# Altium project Sailbot Main Controller.PrjPcb
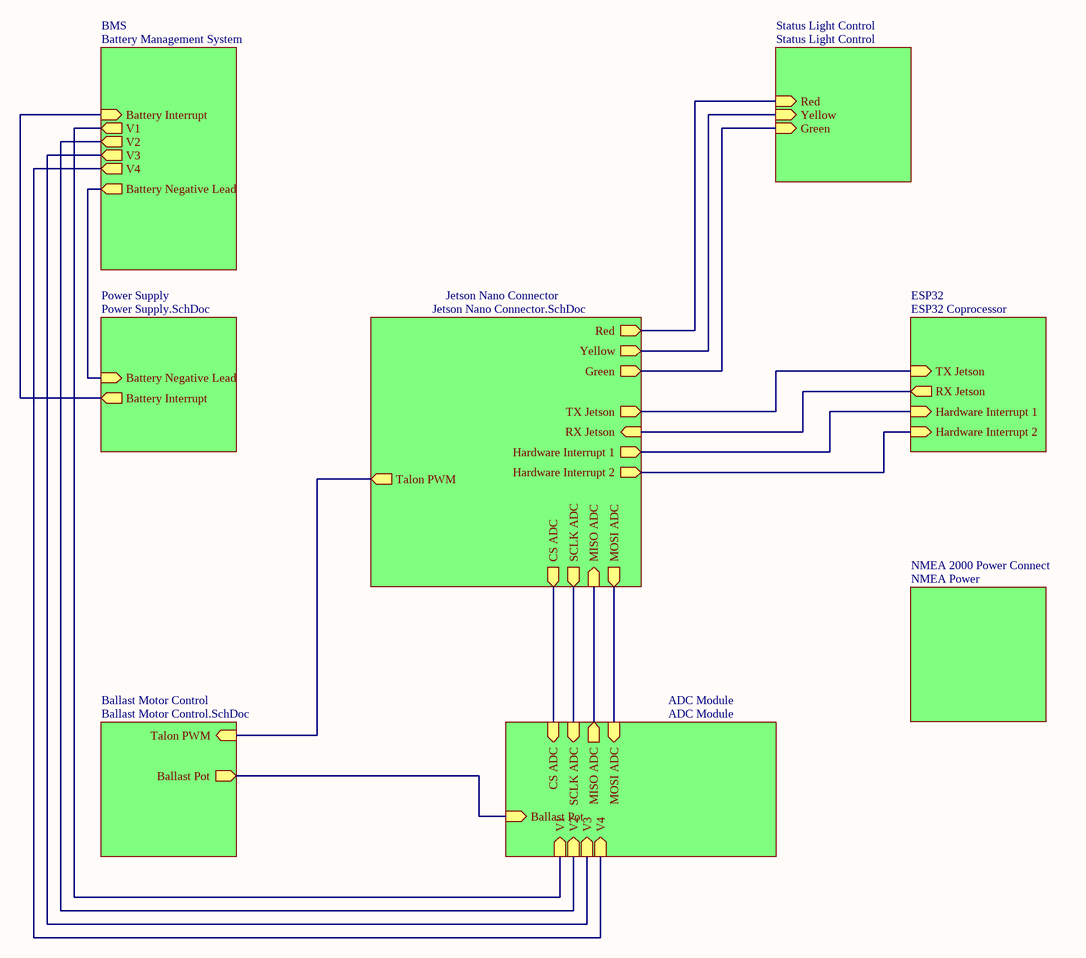
[diagram p0: Sailbot Sheet Map.SchDoc]
12 sheets, 86 parts. Net scope: hierarchical (ports join the sheet entries above them; power ports are global).
Board file: Main Board Layout.PcbDoc
Sheets:
  Sailbot Sheet Map.SchDoc
    Power Supply = Power Supply.SchDoc
    Jetson Nano Connector = Jetson Nano Connector.SchDoc
    Ballast Motor Control = Ballast Motor Control.SchDoc
    ADC Module = ADC Module.SchDoc
    Status Light Control = Status Light Control.SchDoc
    BMS = Battery Management System.SchDoc
    NMEA 2000 Power Connect = NMEA Power.SchDoc
    ESP32 = ESP32 Coprocessor.SchDoc
  Revised Sheetmap.SchDoc
  Initital Sheetmap.SchDoc
  Sail Sheetmap.SchDoc

## Sheet Sailbot Sheet Map.SchDoc
size D; SheetNumber: 1; SheetTotal: 12

### Sub-sheets
ADC Module = ADC Module: Ballast Pot (in), MISO ADC (out), MOSI ADC (in), V1 (in), V2 (in), V3 (in), V4 (in), SCLK ADC (in), CS ADC (in)
Ballast Motor Control = Ballast Motor Control.SchDoc: Talon PWM (in), Ballast Pot (out)
BMS = Battery Management System: Battery Interrupt (in), V1 (out), V2 (out), V3 (out), V4 (out), Battery Negative Lead (out)
ESP32 = ESP32 Coprocessor: TX Jetson (in), RX Jetson (out), Hardware Interrupt 1 (in), Hardware Interrupt 2 (in)
Jetson Nano Connector = Jetson Nano Connector.SchDoc: Red (out), Yellow (out), Green (out), Talon PWM (out), MISO ADC (in), MOSI ADC (out), SCLK ADC (out), CS ADC (out), TX Jetson (out), RX Jetson (in), Hardware Interrupt 1 (out), Hardware Interrupt 2 (out)
NMEA 2000 Power Connect = NMEA Power: no entries
Power Supply = Power Supply.SchDoc: Battery Interrupt (out), Battery Negative Lead (in)
Status Light Control = Status Light Control: Yellow (in), Green (in), Red (in)

### Nets
NetB3_5: sheet Ballast Motor Control/Ballast Pot, sheet ADC Module/Ballast Pot
NetB3_10: sheet Jetson Nano Connector/CS ADC, sheet ADC Module/CS ADC
NetB3_11: sheet Jetson Nano Connector/MOSI ADC, sheet ADC Module/MOSI ADC
NetB3_12: sheet Jetson Nano Connector/MISO ADC, sheet ADC Module/MISO ADC
NetB3_13: sheet Jetson Nano Connector/SCLK ADC, sheet ADC Module/SCLK ADC
NetJ1_11: sheet Power Supply/Battery Negative Lead, sheet BMS/Battery Negative Lead
NetJ2_8: sheet Jetson Nano Connector/TX Jetson, sheet ESP32/TX Jetson
NetJ2_10: sheet Jetson Nano Connector/RX Jetson, sheet ESP32/RX Jetson
NetJ2_12: sheet Jetson Nano Connector/Talon PWM, sheet Ballast Motor Control/Talon PWM
NetJ2_15: sheet Jetson Nano Connector/Green, sheet Status Light Control/Green
NetJ2_29: sheet Jetson Nano Connector/Red, sheet Status Light Control/Red
NetJ2_31: sheet Jetson Nano Connector/Yellow, sheet Status Light Control/Yellow
NetJ2_32: sheet Jetson Nano Connector/Hardware Interrupt 2, sheet ESP32/Hardware Interrupt 2
NetJ2_33: sheet Jetson Nano Connector/Hardware Interrupt 1, sheet ESP32/Hardware Interrupt 1
NetJ10_2: sheet ADC Module/V4, sheet BMS/V4
NetJ10_3: sheet ADC Module/V3, sheet BMS/V3
NetJ10_4: sheet ADC Module/V2, sheet BMS/V2
NetJ10_5: sheet ADC Module/V1, sheet BMS/V1
NetQ1_4: sheet Power Supply/Battery Interrupt, sheet BMS/Battery Interrupt

## Sheet Power Supply.SchDoc
size A; SheetNumber: 2; SheetTotal: 10
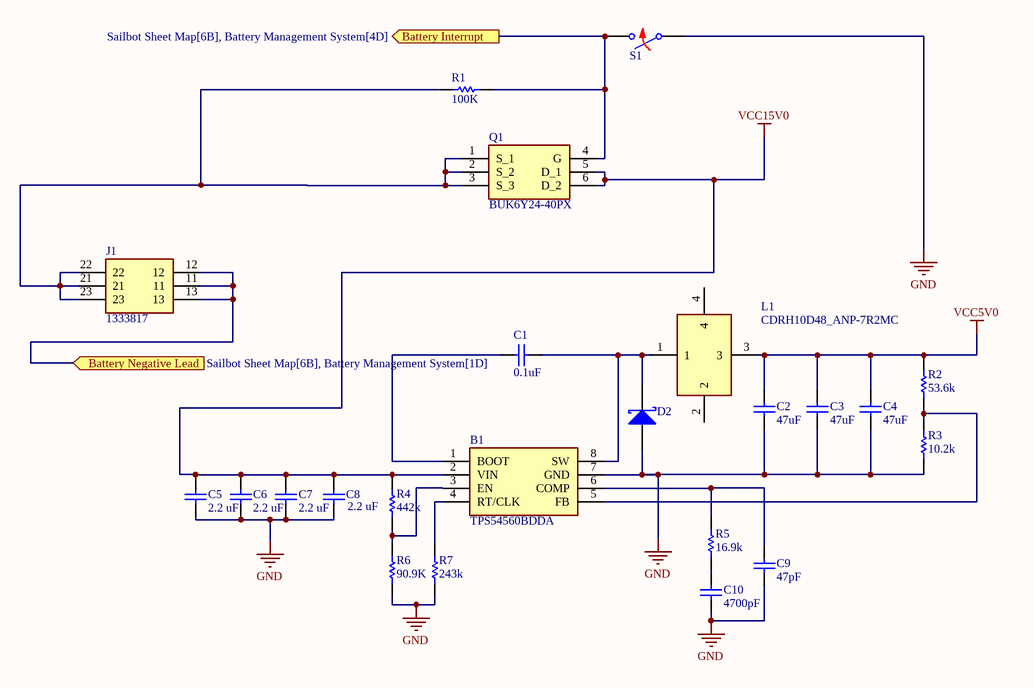
[diagram p1: Power Supply.SchDoc]

### Parts
B1  TPS54560BDDA  [SOIC127P600X170-8N]
C1  value 0.1uF  [C0805]  (hidden comment: Capacitor)
C2  value 47uF  [C0805]  (hidden comment: Capacitor)
C3  value 47uF  [C0805]  (hidden comment: Capacitor)
C4  value 47uF  [C0805]  (hidden comment: Capacitor)
C5  value 2.2 uF  [C0805]  (hidden comment: Capacitor)
C6  value 2.2 uF  [C0805]  (hidden comment: Capacitor)
C7  value 2.2 uF  [C0805]  (hidden comment: Capacitor)
C8  value 2.2 uF  [C0805]  (hidden comment: Capacitor)
C9  value 47pF  [C0805]  (hidden comment: Capacitor)
C10  value 4700pF  [C0805]  (hidden comment: Capacitor)
D2  Shottky Diode  [DIOM7959X250N]  (value not drawn)
J1  1333817  [1333817]
L1  CDRH10D48_ANP-7R2MC  [CDRH10D48ANP7R2MC]
Q1  BUK6Y24-40PX  [BUK6Y2440PX]
R1  value 100K  [6-0805_M]  (hidden comment: Resistor)
R2  value 53.6k  [6-0805_M]  (hidden comment: Resistor)
R3  value 10.2k  [6-0805_M]  (hidden comment: Resistor)
R4  value 442k  [6-0805_M]  (hidden comment: Resistor)
R5  value 16.9k  [6-0805_M]  (hidden comment: Resistor)
R6  value 90.9K  [6-0805_M]  (hidden comment: Resistor)
R7  value 243k  [6-0805_M]  (hidden comment: Resistor)
S1  Switch Normally Opened  (value not drawn)

### Ports
Battery Interrupt (out, see Sailbot Sheet Map[6B], Battery Management System[4D]), Battery Negative Lead (in, see Sailbot Sheet Map[6B], Battery Management System[1D])

### Nets
GND: B1.7(GND) C2.1 C3.1 C4.1 C5.1 C6.1 C7.1 C8.1 C9.1 C10.1 D2.1(A) R3.1 R6.1 R7.1 S1.1
VCC5V0: C2.2 C3.2 C4.2 L1.3 R2.2
VCC15V0: B1.2(VIN) C5.2 C6.2 C7.2 C8.2 Q1.5(D_1) Q1.6(D_2) R4.2
NetB1_1: B1.1(BOOT) C1.1
NetB1_3: B1.3(EN) R4.1 R6.2
NetB1_4: B1.4(RT/CLK) R7.2
NetB1_5: B1.5(FB) R2.1 R3.2
NetB1_6: B1.6(COMP) C9.2 R5.2
NetB1_8: B1.8(SW) C1.2 D2.2(K) L1.1
NetC10_2: C10.2 R5.1
NetJ1_11: J1.11 J1.12 J1.13 ; port Battery Negative Lead
NetJ1_21: J1.21 J1.22 J1.23 Q1.1(S_1) Q1.2(S_2) Q1.3(S_3) R1.1
NetQ1_4: Q1.4(G) R1.2 S1.2 ; port Battery Interrupt

Not connected (* = marked no-connect by the designer): L1 2 4

### Library data of the parts
B1 = TPS54560BDDA: Switching Voltage Regulators A 595-TPS54560BDDAR; Manufacturer_Name: Texas Instruments; Geometry.Height: 1.7mm; Mouser Part Number: 595-TPS54560BDDA; Mouser Price/Stock: https://www.mouser.co.uk/ProductDetail/Texas-Instruments/TPS54560BDDA?qs=gZXFycFWdAMqSdZZ7nACGQ%3D%3D; Manufacturer_Part_Number: TPS54560BDDA; Datasheet Link: http://www.ti.com/lit/ds/symlink/tps54560b.pdf
C1-C10 = Capacitor: SimulationGenericComponent: True
D2 = Shottky Diode: AF: 1; BV: 0; BV_MAX: 1e99; EG: 1.11; FC: 0.5; IBV: 0.001; IS: 1e-14; MJSW: 0.33; NTUN: 30; TNOM: 27; XTI: 3; SimulationGenericComponent: True; CJO: 0; CJP: 0; CTA: 0; CTP: 0; FCS: 0.5; FV_MAX: 1e99; IKF: 0; IKR: 0; ISR: 1e-14; JSW: 0; JTUN: 0; JTUNSW: 0; KEG: 1; KF: 0; LEVEL: 1; N: 1; NBV: 1; NR: 1; NS: 1; PHP: 1; RS: 0; TCV: 0; TLEV: 0; TLEVC: 0; TM1: 0; TM2: 0; TPB: 0; TPHP: 0; TRS: 0; TRS2: 0; TT: 0; TTT1: 0; TTT2: 0; VJ: 1; XTITUN: 3
J1 = 1333817: Pluggable Terminal Blocks LPTA 16/ 2-10,0-ZB; Manufacturer_Name: Phoenix Contact; Geometry.Height: 46.4mm; Mouser Part Number: 651-1333817; Mouser Price/Stock: https://www.mouser.co.uk/ProductDetail/Phoenix-Contact/1333817?qs=Jm2GQyTW%2Fbi%252BbQzIAqu7ww%3D%3D; Manufacturer_Part_Number: 1333817; Datasheet Link: https://www.phoenixcontact.com/en-pc/products/pcb-terminal-block-lpta-16-2-100-zb-1333817
L1 = CDRH10D48_ANP-7R2MC: Fixed Inductors SMD Power Inductor; Manufacturer_Name: Sumida; Manufacturer_Part_Number: CDRH10D48/ANP-7R2MC; Geometry.Height: 5mm; Mouser Part Number: 851-CDRH10D48/ANP7R2; Mouser Price/Stock: https://www.mouser.co.uk/ProductDetail/Sumida/CDRH10D48-ANP-7R2MC?qs=mT6umqgwvA2FCldKZoKGVw%3D%3D; Datasheet Link: https://datasheet.datasheetarchive.com/originals/distributors/Datasheets-DGA11/2227373.pdf
Q1 = BUK6Y24-40PX: NEXPERIA - BUK6Y24-40PX - Power MOSFET, P Channel, 40 V, 39 A, 0.019 ohm, LFPAK56, Surface Mount; Geometry.Height: 1.2mm; Mouser Part Number: 771-BUK6Y24-40PX; Mouser Price/Stock: https://www.mouser.co.uk/ProductDetail/Nexperia/BUK6Y24-40PX?qs=vmHwEFxEFR8tyd2WwTEwBg%3D%3D; Manufacturer_Name: Nexperia; Manufacturer_Part_Number: BUK6Y24-40PX; Datasheet Link: https://assets.nexperia.com/documents/data-sheet/BUK6Y24-40P.pdf
R1-R7 = Resistor: TC1: 0; SimulationGenericComponent: True; TC2: 0
S1 = SW NO: closed: 0; Rclosed: 1m; Ropen: 1Meg; SimulationGenericComponent: True

## Sheet Jetson Nano Connector.SchDoc
size A; SheetNumber: 4; SheetTotal: 12
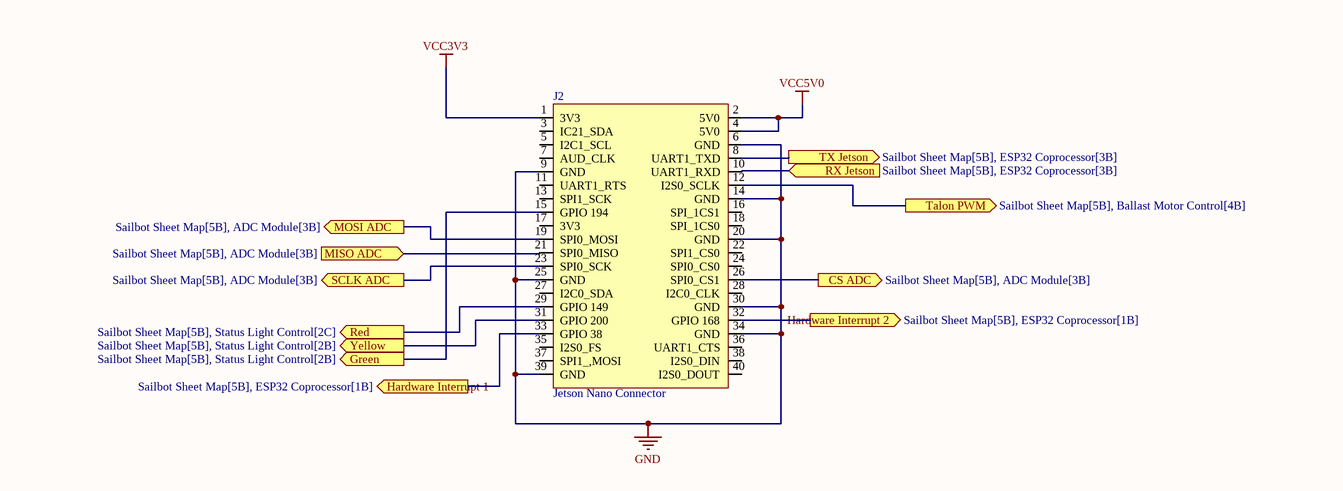
[diagram p2: Jetson Nano Connector.SchDoc]

### Parts
J2  Jetson Nano Connector  [Jetson Nano Header]

### Ports
CS ADC (out, see Sailbot Sheet Map[5B], ADC Module[3B]), Green (out, see Sailbot Sheet Map[5B], Status Light Control[2B]), Hardware Interrupt 1 (out, see Sailbot Sheet Map[5B], ESP32 Coprocessor[1B]), Hardware Interrupt 2 (out, see Sailbot Sheet Map[5B], ESP32 Coprocessor[1B]), MISO ADC (in, see Sailbot Sheet Map[5B], ADC Module[3B]), MOSI ADC (out, see Sailbot Sheet Map[5B], ADC Module[3B]), Red (out, see Sailbot Sheet Map[5B], Status Light Control[2C]), RX Jetson (in, see Sailbot Sheet Map[5B], ESP32 Coprocessor[3B]), SCLK ADC (out, see Sailbot Sheet Map[5B], ADC Module[3B]), Talon PWM (out, see Sailbot Sheet Map[5B], Ballast Motor Control[4B]), TX Jetson (out, see Sailbot Sheet Map[5B], ESP32 Coprocessor[3B]), Yellow (out, see Sailbot Sheet Map[5B], Status Light Control[2B])

### Nets
GND: J2.6(GND) J2.9(GND) J2.14(GND) J2.20(GND) J2.25(GND) J2.30(GND) J2.34(GND) J2.39(GND)
VCC3V3: J2.1(3V3)
VCC5V0: J2.2(5V0) J2.4(5V0)
NetB3_10: J2.26(SPI0_CS1) ; port CS ADC
NetB3_11: J2.19(SPI0_MOSI) ; port MOSI ADC
NetB3_12: J2.21(SPI0_MISO) ; port MISO ADC
NetB3_13: J2.23(SPI0_SCK) ; port SCLK ADC
NetJ2_8: J2.8(UART1_TXD) ; port TX Jetson
NetJ2_10: J2.10(UART1_RXD) ; port RX Jetson
NetJ2_12: J2.12(I2S0_SCLK) ; port Talon PWM
NetJ2_15: J2.15(GPIO_194) ; port Green
NetJ2_29: J2.29(GPIO_149) ; port Red
NetJ2_31: J2.31(GPIO_200) ; port Yellow
NetJ2_32: J2.32(GPIO_168) ; port Hardware Interrupt 2
NetJ2_33: J2.33(GPIO_38) ; port Hardware Interrupt 1

Not connected (* = marked no-connect by the designer): J2 3(IC21_SDA) 5(I2C1_SCL) 7(AUD_CLK) 11(UART1_RTS) 13(SPI1_SCK) 16(SPI_1CS1) 17(3V3) 18(SPI_1CS0) 22(SPI1_CS0) 24(SPI0_CS0) 27(I2C0_SDA) 28(I2C0_CLK) 35(I2S0_FS) 36(UART1_CTS) 37(SPI1_,MOSI) 38(I2S0_DIN) 40(I2S0_DOUT)

## Sheet Ballast Motor Control.SchDoc
size A; SheetNumber: 9; SheetTotal: 12
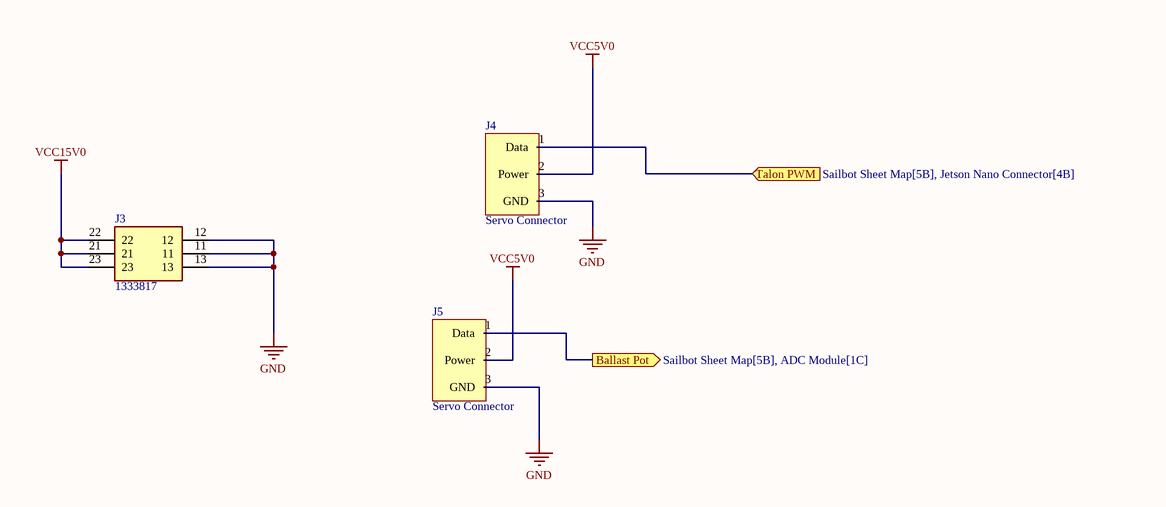
[diagram p3: Ballast Motor Control.SchDoc]

### Parts
(Parts that share a designator on the sheet are numbered #1, #2 ... from top to bottom, then left to right.)
J3#1  1333817  [1333817]
J4#1  Servo Connector  [3 Pin 0.1in Header]
J5#1  Servo Connector  [3 Pin 0.1in Header]

### Ports
Ballast Pot (out, see Sailbot Sheet Map[5B], ADC Module[1C]), Talon PWM (in, see Sailbot Sheet Map[5B], Jetson Nano Connector[4B])

### Nets
GND: J3#1.11 J3#1.12 J3#1.13 J4#1.3(GND) J5#1.3(GND)
VCC5V0: J4#1.2(Power) J5#1.2(Power)
VCC15V0: J3#1.21 J3#1.22 J3#1.23
NetB3_5: J5#1.1(Data) ; port Ballast Pot
NetJ2_12: J4#1.1(Data) ; port Talon PWM

### Library data of the parts
J3#1 = 1333817: as J1 on sheet Power Supply; Mouser Part Number: 651-1333817; Mouser Price/Stock: https://www.mouser.co.uk/ProductDetail/Phoenix-Contact/1333817?qs=Jm2GQyTW%2Fbi%252BbQzIAqu7ww%3D%3D; Manufacturer_Part_Number: 1333817; Datasheet Link: https://www.phoenixcontact.com/en-pc/products/pcb-terminal-block-lpta-16-2-100-zb-1333817

## Sheet ADC Module.SchDoc
size A; SheetNumber: 6; SheetTotal: 9
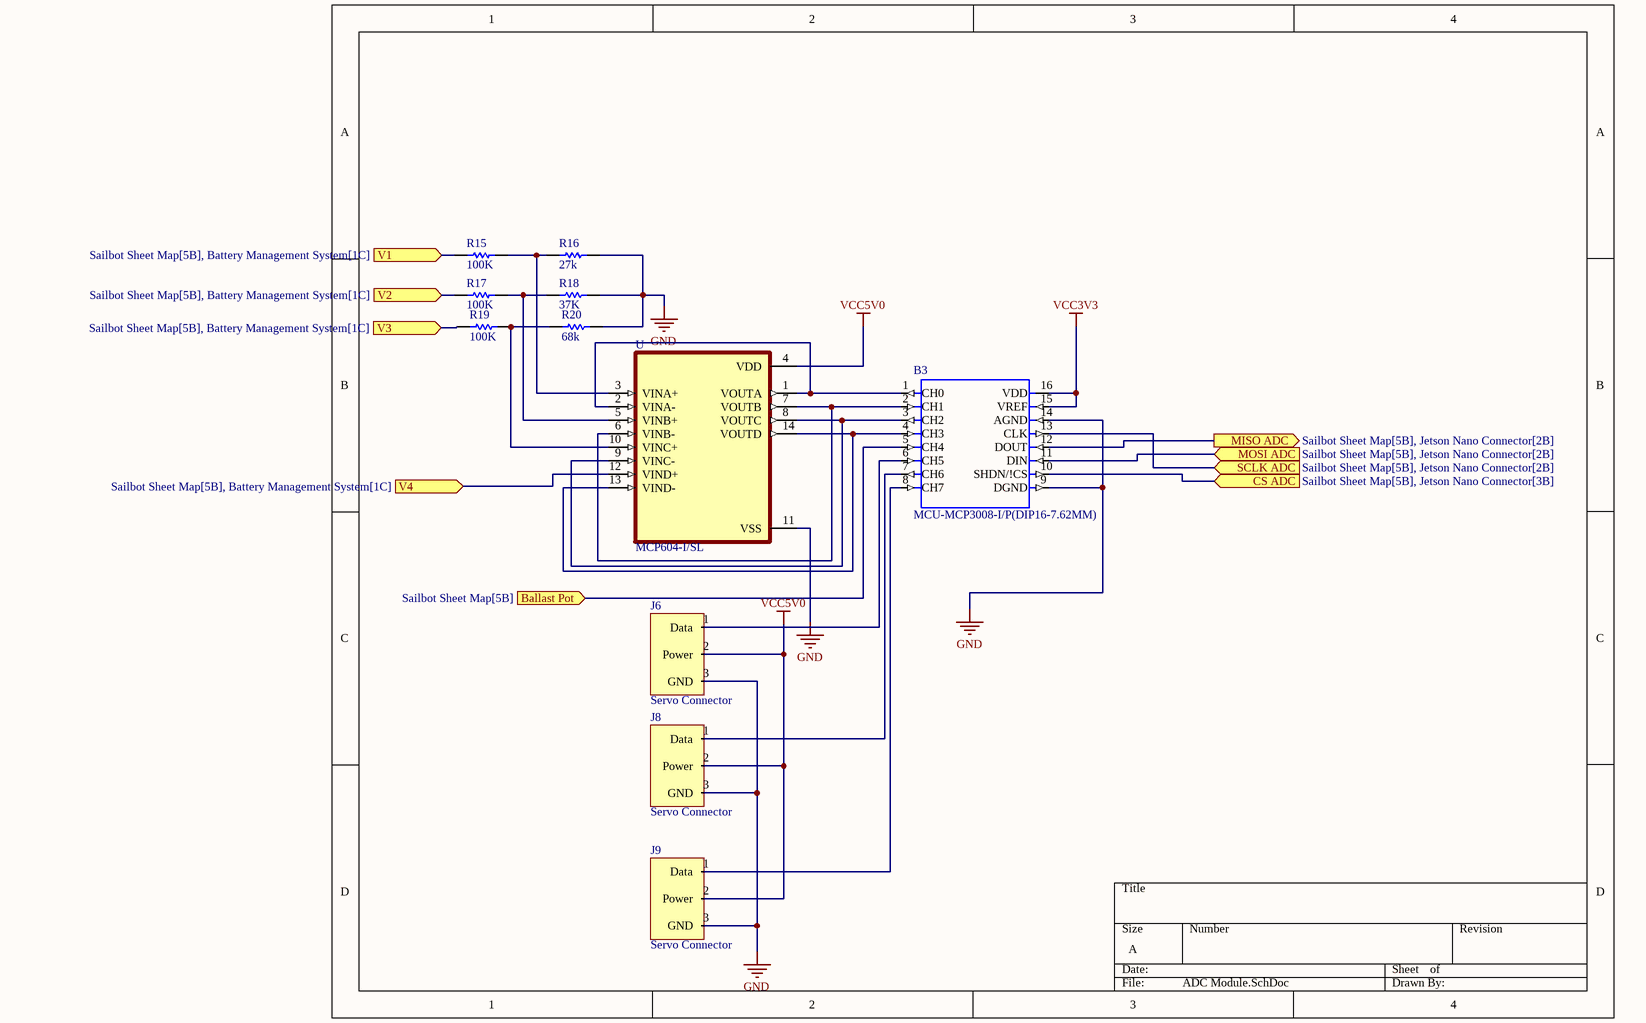
[diagram p4: ADC Module.SchDoc]

### Parts
B3  MCU-MCP3008-I/P(DIP16-7.62MM)  [DIP16-2.54-19.2X7.62MM]
J6  Servo Connector  [3 Pin 0.1in Header]
J8  Servo Connector  [3 Pin 0.1in Header]
J9  Servo Connector  [3 Pin 0.1in Header]
R15  value 100K  [6-0805_M]  (hidden comment: Resistor)
R16  value 27k  [6-0805_M]  (hidden comment: Resistor)
R17  value 100K  [6-0805_M]  (hidden comment: Resistor)
R18  value 37K  [6-0805_M]  (hidden comment: Resistor)
R19  value 100K  [6-0805_M]  (hidden comment: Resistor)
R20  value 68k  [6-0805_M]  (hidden comment: Resistor)
U  MCP604-I/SL  [SOIC127P600X175-14N]

### Ports
Ballast Pot (in, see Sailbot Sheet Map[5B]), CS ADC (in, see Sailbot Sheet Map[5B], Jetson Nano Connector[3B]), MISO ADC (out, see Sailbot Sheet Map[5B], Jetson Nano Connector[2B]), MOSI ADC (in, see Sailbot Sheet Map[5B], Jetson Nano Connector[2B]), SCLK ADC (in, see Sailbot Sheet Map[5B], Jetson Nano Connector[2B]), V1 (in, see Sailbot Sheet Map[5B], Battery Management System[1C]), V2 (in, see Sailbot Sheet Map[5B], Battery Management System[1C]), V3 (in, see Sailbot Sheet Map[5B], Battery Management System[1C]), V4 (in, see Sailbot Sheet Map[5B], Battery Management System[1C])

### Nets
GND: B3.9(DGND) B3.14(AGND) J6.3(GND) J8.3(GND) J9.3(GND) R16.1 R18.1 R20.2 U.11(VSS)
VCC3V3: B3.15(VREF) B3.16(VDD)
VCC5V0: J6.2(Power) J8.2(Power) J9.2(Power) U.4(VDD)
NetB3_1: B3.1(CH0) U.1(VOUTA) U.2(VINA-)
NetB3_2: B3.2(CH1) U.6(VINB-) U.7(VOUTB)
NetB3_3: B3.3(CH2) U.8(VOUTC) U.9(VINC-)
NetB3_4: B3.4(CH3) U.13(VIND-) U.14(VOUTD)
NetB3_5: B3.5(CH4) ; port Ballast Pot
NetB3_6: B3.6(CH5) J6.1(Data)
NetB3_7: B3.7(CH6) J8.1(Data)
NetB3_8: B3.8(CH7) J9.1(Data)
NetB3_10: B3.10(SHDN/!CS) ; port CS ADC
NetB3_11: B3.11(DIN) ; port MOSI ADC
NetB3_12: B3.12(DOUT) ; port MISO ADC
NetB3_13: B3.13(CLK) ; port SCLK ADC
NetJ10_2: U.12(VIND+) ; port V4
NetJ10_3: R19.2 ; port V3
NetJ10_4: R17.2 ; port V2
NetJ10_5: R15.2 ; port V1
NetR15_1: R15.1 R16.2 U.3(VINA+)
NetR17_1: R17.1 R18.2 U.5(VINB+)
NetR19_1: R19.1 R20.1 U.10(VINC+)

### Library data of the parts
B3 = MCU-MCP3008-I/P(DIP16-7.62MM): 10 Bit Analog to Digital Converter 4, 8 Input 1 SAR 16-PDIP; MF: Microchip; MP: MCP3008-I/P; Package: DIP-16 Microchip; SnapEDA_Link: https://www.snapeda.com/parts/MCP3008-I/P/Microchip/view-part/43628/?ref=snap; Availability: Unavailable; Price: None; Value: *
R15-R20 = Resistor: TC1: 0; SimulationGenericComponent: True; TC2: 0
U = MCP604-I/SL: General Purpose Amplifier 4 Circuit Rail-to-Rail 14-SOIC; MF: Microchip; Value: *; Package: SOIC-14 Microchip; MP: MCP604-I/SL; Price: None; SnapEDA_Link: https://www.snapeda.com/parts/MCP604-I/SL/Microchip/view-part/49119/?ref=snap; Availability: Unavailable

## Sheet Status Light Control.SchDoc
size A; SheetNumber: 4; SheetTotal: 10
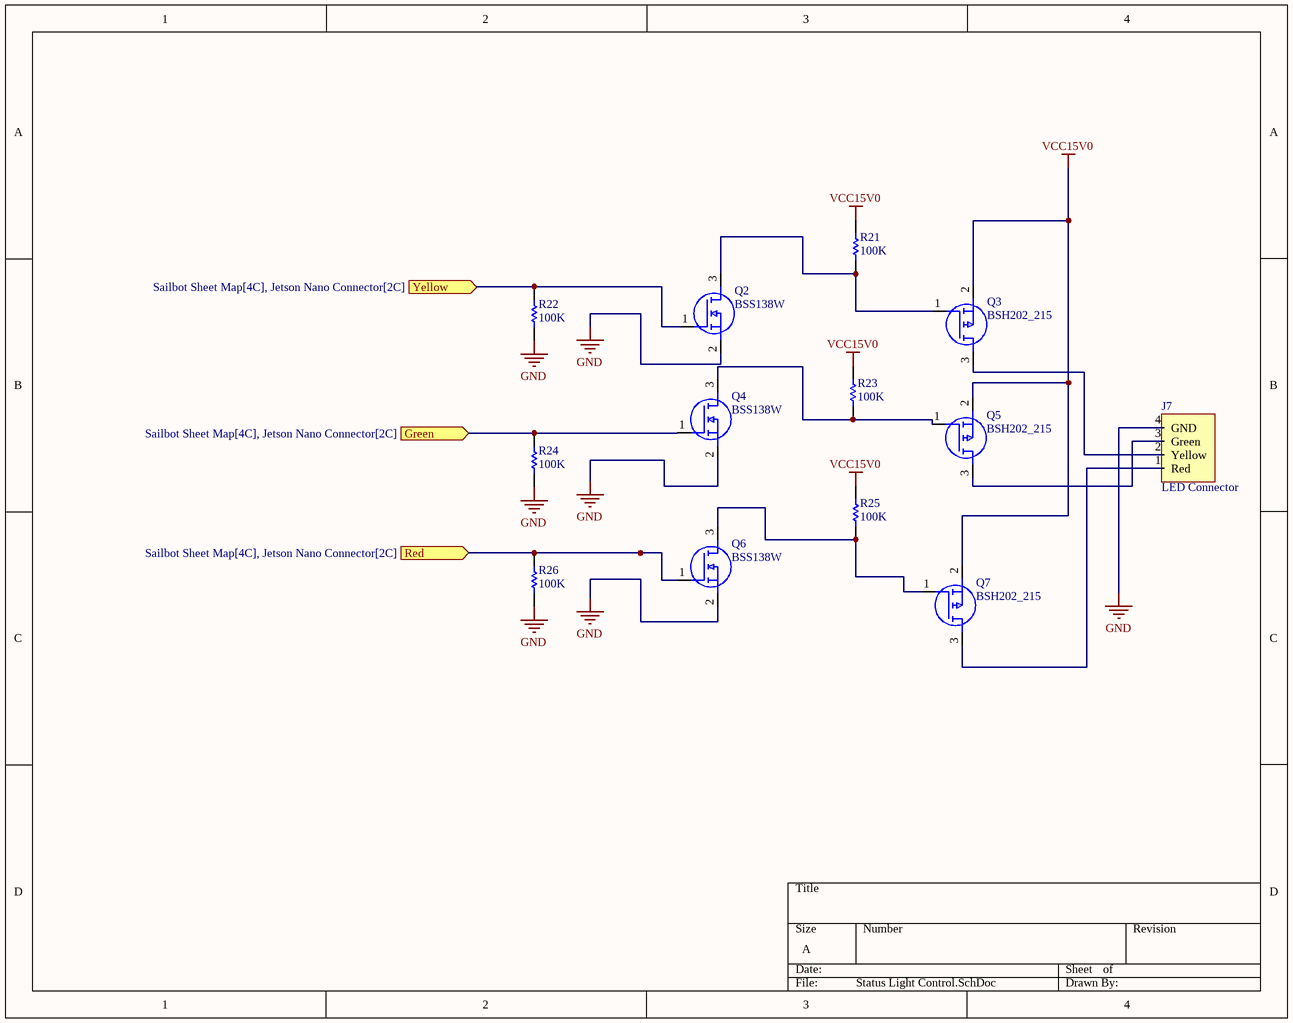
[diagram p5: Status Light Control.SchDoc]

### Parts
J7  LED Connector  [4 Pin 0.1in Header]
Q2  BSS138W  [SOT65P210X110-3N]
Q3  BSH202_215  [SOT95P230X110-3N]
Q4  BSS138W  [SOT65P210X110-3N]
Q5  BSH202_215  [SOT95P230X110-3N]
Q6  BSS138W  [SOT65P210X110-3N]
Q7  BSH202_215  [SOT95P230X110-3N]
R21  value 100K  [6-0805_M]  (hidden comment: Resistor)
R22  value 100K  [6-0805_M]  (hidden comment: Resistor)
R23  value 100K  [6-0805_M]  (hidden comment: Resistor)
R24  value 100K  [6-0805_M]  (hidden comment: Resistor)
R25  value 100K  [6-0805_M]  (hidden comment: Resistor)
R26  value 100K  [6-0805_M]  (hidden comment: Resistor)

### Ports
Green (in, see Sailbot Sheet Map[4C], Jetson Nano Connector[2C]), Red (in, see Sailbot Sheet Map[4C], Jetson Nano Connector[2C]), Yellow (in, see Sailbot Sheet Map[4C], Jetson Nano Connector[2C])

### Nets
GND: J7.4(GND) Q2.2(S) Q4.2(S) Q6.2(S) R22.1 R24.1 R26.1
VCC15V0: Q3.2(S) Q5.2(S) Q7.2(S) R21.2 R23.2 R25.2
NetJ2_15: Q4.1(G) R24.2 ; port Green
NetJ2_29: Q6.1(G) R26.2 ; port Red
NetJ2_31: Q2.1(G) R22.2 ; port Yellow
NetJ7_1: J7.1(Red) Q7.3(D)
NetJ7_2: J7.2(Yellow) Q3.3(D)
NetJ7_3: J7.3(Green) Q5.3(D)
NetQ2_3: Q2.3(D) Q3.1(G) R21.1
NetQ4_3: Q4.3(D) Q5.1(G) R23.1
NetQ6_3: Q6.3(D) Q7.1(G) R25.1

### Library data of the parts
Q2 Q4 Q6 = BSS138W: BSS138W N-Channel MOSFET, 210 mA, 50 V, 3-Pin SOT-323 ON Semiconductor; Manufacturer_Name: onsemi; Geometry.Height: 1.1mm; Mouser Part Number: 512-BSS138W; Mouser Price/Stock: https://www.mouser.co.uk/ProductDetail/onsemi-Fairchild/BSS138W?qs=iQhsftLtcNQX02h325QGXg%3D%3D; Manufacturer_Part_Number: BSS138W; Datasheet Link: https://www.onsemi.com/pub/Collateral/BSS138W-D.pdf
Q3 Q5 Q7 = BSH202_215: NEXPERIA - BSH202,215 - Power MOSFET, P Channel, 30 V, 520 mA, 0.63 ohm, SOT-23, Surface Mount; Geometry.Height: 1.1mm; Mouser Part Number: 771-BSH202215; Mouser Price/Stock: https://www.mouser.co.uk/ProductDetail/Nexperia/BSH202215?qs=me8TqzrmIYVIfEr%252BmEwLmg%3D%3D; Manufacturer_Name: Nexperia; Manufacturer_Part_Number: BSH202,215; Datasheet Link: https://assets.nexperia.com/documents/data-sheet/BSH202.pdf
R21-R26 = Resistor: TC1: 0; SimulationGenericComponent: True; TC2: 0

## Sheet Battery Management System.SchDoc
size A; SheetNumber: 5; SheetTotal: 9
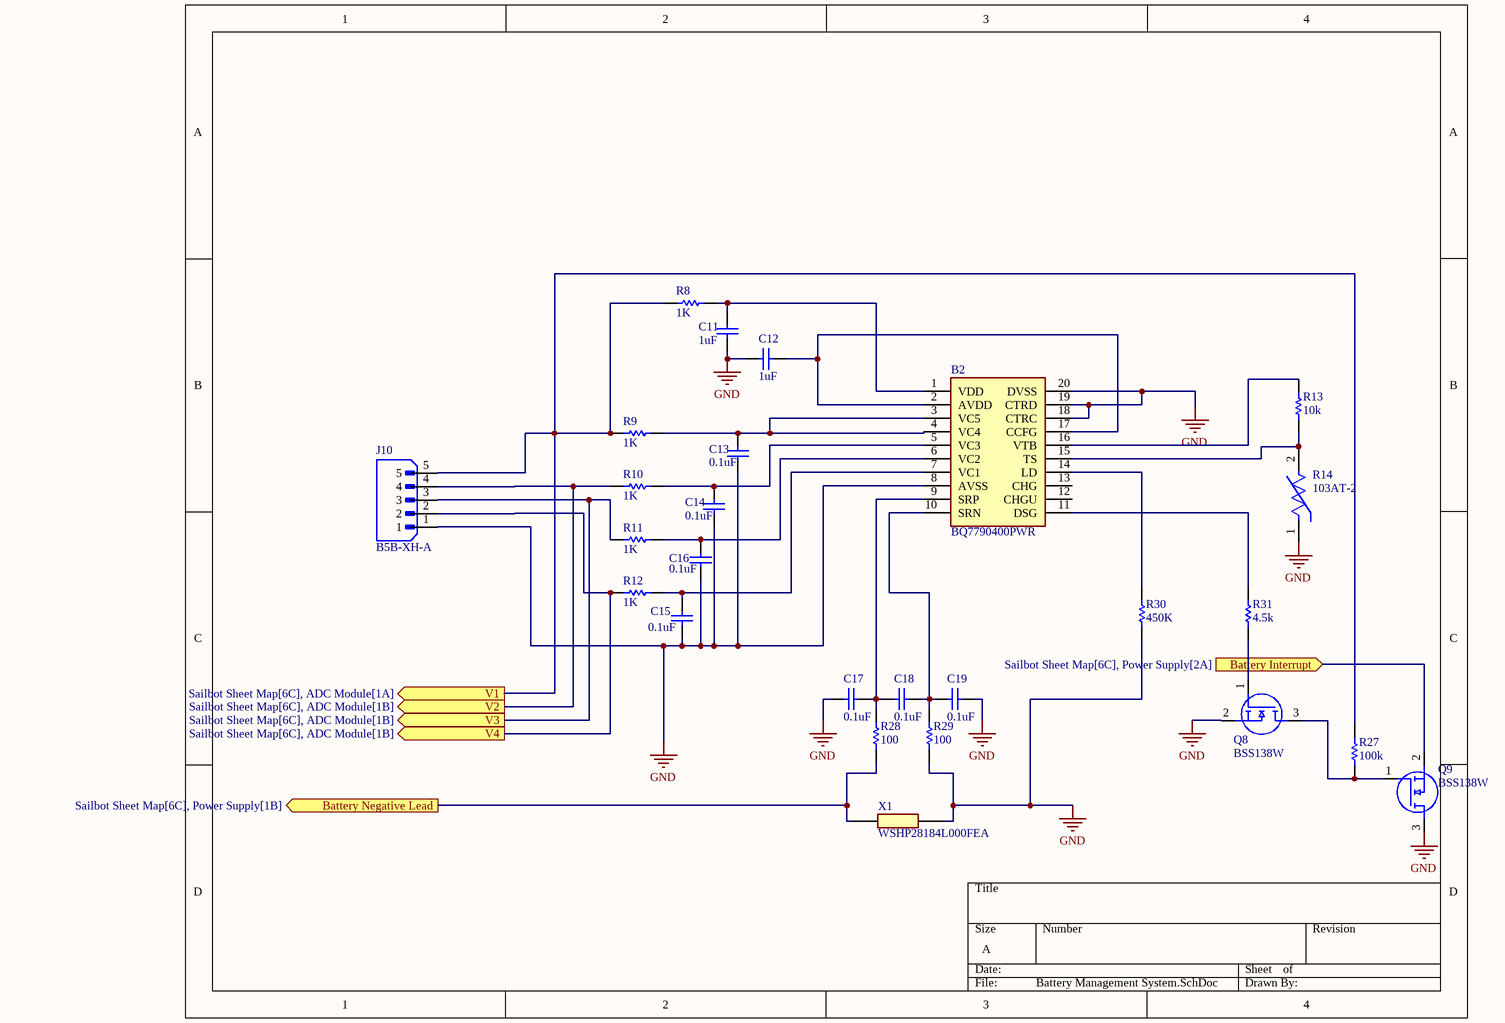
[diagram p6: Battery Management System.SchDoc]

### Parts
B2  BQ7790400PWR  [SOP65P640X120-20N]
C11  value 1uF  [C0805]  (hidden comment: Capacitor)
C12  value 1uF  [C0805]  (hidden comment: Capacitor)
C13  value 0.1uF  [C0805]  (hidden comment: Capacitor)
C14  value 0.1uF  [C0805]  (hidden comment: Capacitor)
C15  value 0.1uF  [C0805]  (hidden comment: Capacitor)
C16  value 0.1uF  [C0805]  (hidden comment: Capacitor)
C17  value 0.1uF  [C0805]  (hidden comment: Capacitor)
C18  value 0.1uF  [C0805]  (hidden comment: Capacitor)
C19  value 0.1uF  [C0805]  (hidden comment: Capacitor)
J10  B5B-XH-A  [JST_B5B-XH-A]
Q8  BSS138W  [SOT65P210X110-3N]
Q9  BSS138W  [SOT65P210X110-3N]
R8  value 1K  [6-0805_M]  (hidden comment: Resistor)
R9  value 1K  [6-0805_M]  (hidden comment: Resistor)
R10  value 1K  [6-0805_M]  (hidden comment: Resistor)
R11  value 1K  [6-0805_M]  (hidden comment: Resistor)
R12  value 1K  [6-0805_M]  (hidden comment: Resistor)
R13  value 10k  [6-0805_M]  (hidden comment: Resistor)
R14  103AT-2  [FP-103AT-2-MFG]
R27  value 100k  [6-0805_M]  (hidden comment: Resistor)
R28  value 100  [6-0805_M]  (hidden comment: Resistor)
R29  value 100  [6-0805_M]  (hidden comment: Resistor)
R30  value 450K  [6-0805_M]  (hidden comment: Resistor)
R31  value 4.5k  [6-0805_M]  (hidden comment: Resistor)
X1  WSHP28184L000FEA  [WSHP28184L000FEA]

### Ports
Battery Interrupt (in, see Sailbot Sheet Map[6C], Power Supply[2A]), Battery Negative Lead (out, see Sailbot Sheet Map[6C], Power Supply[1B]), V1 (out, see Sailbot Sheet Map[6C], ADC Module[1A]), V2 (out, see Sailbot Sheet Map[6C], ADC Module[1B]), V3 (out, see Sailbot Sheet Map[6C], ADC Module[1B]), V4 (out, see Sailbot Sheet Map[6C], ADC Module[1B])

### Nets
GND: B2.8(AVSS) B2.18(CTRC) B2.19(CTRD) B2.20(DVSS) C11.1 C12.2 C13.1 C14.1 C15.1 C16.1 C17.2 C19.1 J10.1 Q8.2(S) Q9.3(D) R14.1 R29.1 R30.1 X1.2
NetB2_1: B2.1(VDD) C11.2 R8.2
NetB2_2: B2.2(AVDD) B2.17(CCFG) C12.1
NetB2_3: B2.3(VC5) B2.4(VC4) C13.2 R9.2
NetB2_5: B2.5(VC3) C14.2 R10.2
NetB2_6: B2.6(VC2) C16.2 R11.2
NetB2_7: B2.7(VC1) C15.2 R12.2
NetB2_9: B2.9(SRP) C17.1 C18.2 R28.2
NetB2_10: B2.10(SRN) C18.1 C19.2 R29.2
NetB2_11: B2.11(DSG) R31.2
NetB2_14: B2.14(LD) R30.2
NetB2_15: B2.15(TS) R13.1 R14.2
NetB2_16: B2.16(VTB) R13.2
NetJ1_11: R28.1 X1.1 ; port Battery Negative Lead
NetJ10_2: J10.2 R12.1 ; port V4
NetJ10_3: J10.3 R11.1 ; port V3
NetJ10_4: J10.4 R10.1 ; port V2
NetJ10_5: J10.5 R8.1 R9.1 R27.2 ; port V1
NetQ1_4: Q9.2(S) ; port Battery Interrupt
NetQ8_1: Q8.1(G) R31.1
NetQ8_3: Q8.3(D) Q9.1(G) R27.1

Not connected (* = marked no-connect by the designer): B2 12(CHGU) 13(CHG)

### Library data of the parts
B2 = BQ7790400PWR: 3-4S Low Power Protector; Manufacturer_Name: Texas Instruments; Geometry.Height: 1.2mm; Mouser Part Number: 595-BQ7790400PWR; Mouser Price/Stock: https://www.mouser.co.uk/ProductDetail/Texas-Instruments/BQ7790400PWR?qs=SMCV84mnLhnU0KDK1YzY%252Bw%3D%3D; Manufacturer_Part_Number: BQ7790400PWR; Datasheet Link: http://www.ti.com/lit/gpn/bq77904
C11-C19 = Capacitor: SimulationGenericComponent: True
J10 = B5B-XH-A: Connector Header Through Hole 5 position 0.098 (2.50mm); MF: JST Sales; SnapEDA_Link: https://www.snapeda.com/parts/B5B-XH-A/JST+Sales+America+Inc./view-part/?ref=snap; Package: None; Value: *; MP: B5B-XH-A; Check_prices: https://www.snapeda.com/parts/B5B-XH-A/JST+Sales+America+Inc./view-part/?ref=eda
Q8 Q9 = BSS138W: as Q2 on sheet Status Light Control; Mouser Part Number: 512-BSS138W; Mouser Price/Stock: https://www.mouser.co.uk/ProductDetail/onsemi-Fairchild/BSS138W?qs=iQhsftLtcNQX02h325QGXg%3D%3D; Manufacturer_Part_Number: BSS138W; Datasheet Link: https://www.onsemi.com/pub/Collateral/BSS138W-D.pdf
R8-R13 R27-R31 = Resistor: TC1: 0; SimulationGenericComponent: True; TC2: 0
R14 = CMP-2000-05824-2: Thermistor NTC 10KOhm 1% 2-Pin; Resistance: 10kR; Lead Pitch: 2.54mm; Height: 2.4mm; Max Operating Temperature: 110°C; Width: 3.7mm; RoHS Compliant: Yes; Min Operating Temperature: -50°C; Termination: Radial; Packaging: Bulk; Number of Pins: 2; Series: AT; Tolerance: 1%; Length: 17mm
X1 = WSHP28184L000FEA: Current Sense Resistors - SMD 10W .004ohms 1%; Manufacturer_Name: Vishay; Geometry.Height: 1.75mm; Mouser Part Number: 71-WSHP28184L000FEA; Mouser Price/Stock: https://www.mouser.co.uk/ProductDetail/Vishay-Dale/WSHP28184L000FEA?qs=WY0B%252Bpw29jP7%252BmGFaWxGvg%3D%3D; Manufacturer_Part_Number: WSHP28184L000FEA; Datasheet Link: https://www.vishay.com/doc?30347

## Sheet NMEA Power.SchDoc
size A; SheetNumber: 8; SheetTotal: 11
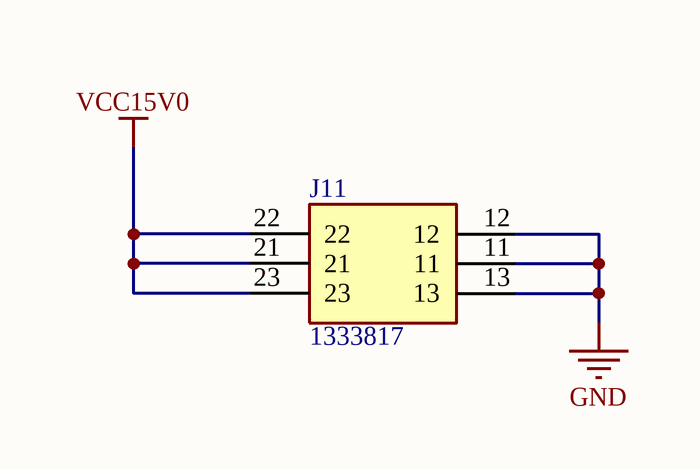
[diagram p7: NMEA Power.SchDoc]

### Parts
(Parts that share a designator on the sheet are numbered #1, #2 ... from top to bottom, then left to right.)
J11#1  1333817  [1333817]

### Nets
GND: J11#1.11 J11#1.12 J11#1.13
VCC15V0: J11#1.21 J11#1.22 J11#1.23

### Library data of the parts
J11#1 = 1333817: as J1 on sheet Power Supply; Mouser Part Number: 651-1333817; Mouser Price/Stock: https://www.mouser.co.uk/ProductDetail/Phoenix-Contact/1333817?qs=Jm2GQyTW%2Fbi%252BbQzIAqu7ww%3D%3D; Manufacturer_Part_Number: 1333817; Datasheet Link: https://www.phoenixcontact.com/en-pc/products/pcb-terminal-block-lpta-16-2-100-zb-1333817

## Sheet ESP32 Coprocessor.SchDoc
size A; SheetNumber: 9; SheetTotal: 12
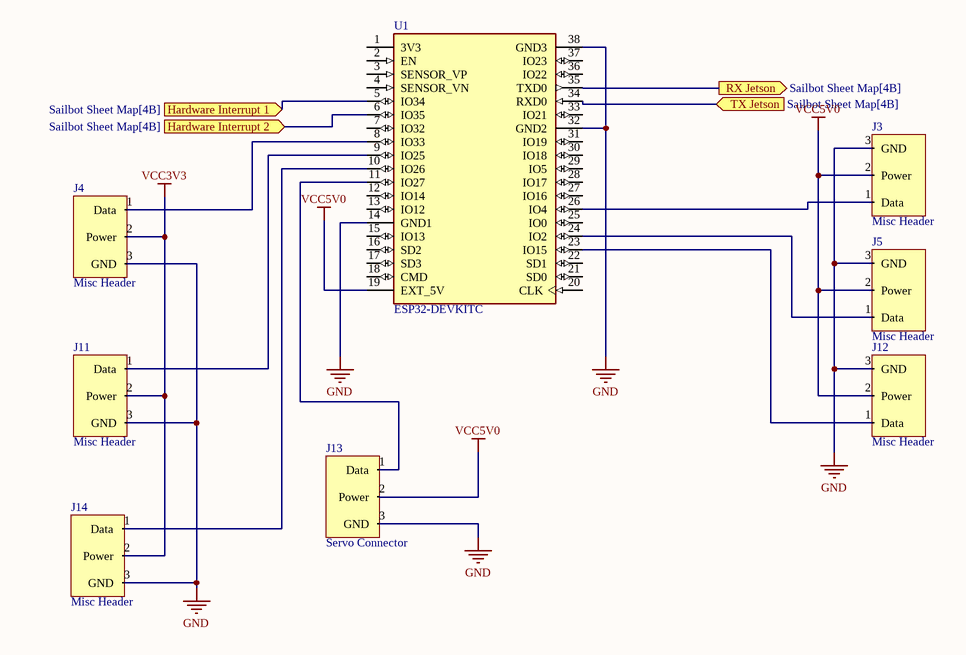
[diagram p8: ESP32 Coprocessor.SchDoc]

### Parts
(Parts that share a designator on the sheet are numbered #1, #2 ... from top to bottom, then left to right.)
J3#2  Misc Header  [3 Pin 0.1in Header]
J4#2  Misc Header  [3 Pin 0.1in Header]
J5#2  Misc Header  [3 Pin 0.1in Header]
J11#2  Misc Header  [3 Pin 0.1in Header]
J12  Misc Header  [3 Pin 0.1in Header]
J13  Servo Connector  [3 Pin 0.1in Header]
J14  Misc Header  [3 Pin 0.1in Header]
U1  ESP32-DEVKITC  [MODULE_ESP32-DEVKITC]

### Ports
Hardware Interrupt 1 (in, see Sailbot Sheet Map[4B]), Hardware Interrupt 2 (in, see Sailbot Sheet Map[4B]), RX Jetson (out, see Sailbot Sheet Map[4B]), TX Jetson (in, see Sailbot Sheet Map[4B])

### Nets
GND: J3#2.3(GND) J4#2.3(GND) J5#2.3(GND) J11#2.3(GND) J12.3(GND) J13.3(GND) J14.3(GND) U1.14(GND1) U1.32(GND2) U1.38(GND3)
VCC3V3: J4#2.2(Power) J11#2.2(Power) J14.2(Power)
VCC5V0: J3#2.2(Power) J5#2.2(Power) J12.2(Power) J13.2(Power) U1.19(EXT_5V)
NetJ2_8: U1.34(RXD0) ; port TX Jetson
NetJ2_10: U1.35(TXD0) ; port RX Jetson
NetJ2_32: U1.6(IO35) ; port Hardware Interrupt 2
NetJ2_33: U1.5(IO34) ; port Hardware Interrupt 1
NetJ3#2_1: J3#2.1(Data) U1.26(IO4)
NetJ4#2_1: J4#2.1(Data) U1.8(IO33)
NetJ5#2_1: J5#2.1(Data) U1.24(IO2)
NetJ11#2_1: J11#2.1(Data) U1.9(IO25)
NetJ12_1: J12.1(Data) U1.23(IO15)
NetJ13_1: J13.1(Data) U1.11(IO27)
NetJ14_1: J14.1(Data) U1.10(IO26)

Not connected (* = marked no-connect by the designer): U1 1(3V3) 2(EN) 3(SENSOR_VP) 4(SENSOR_VN) 7(IO32) 12(IO14) 13(IO12) 15(IO13) 16(SD2) 17(SD3) 18(CMD) 20(CLK) 21(SD0) 22(SD1) 25(IO0) 27(IO16) 28(IO17) 29(IO5) 30(IO18) 31(IO19) 33(IO21) 36(IO22) 37(IO23)

### Library data of the parts
J3#2 J4#2 J5#2 J11#2 J12 J14 = Servo Connector
U1 = ESP32-DEVKITC: ESP32-WROOM-32UE series Transceiver; 802.11 b/g/n (Wi-Fi, WiFi, WLAN), Bluetooth Â® Smart Ready 4.x Dual Mode Evaluation Board; MF: Espressif Systems; Value: *; SnapEDA_Link: https://www.snapeda.com/parts/ESP32-DEVKITC/Espressif+Systems/view-part/?ref=snap; MP: ESP32-DEVKITC; Purchase-URL: https://pricing.snapeda.com/search/part/ESP32-DEVKITC/?ref=eda; Check_prices: https://www.snapeda.com/parts/ESP32-DEVKITC/Espressif+Systems/view-part/?ref=eda; Availability: In Stock; Price: None; Package: None

## Sheet Revised Sheetmap.SchDoc
size A; SheetNumber: 5; SheetTotal: 5
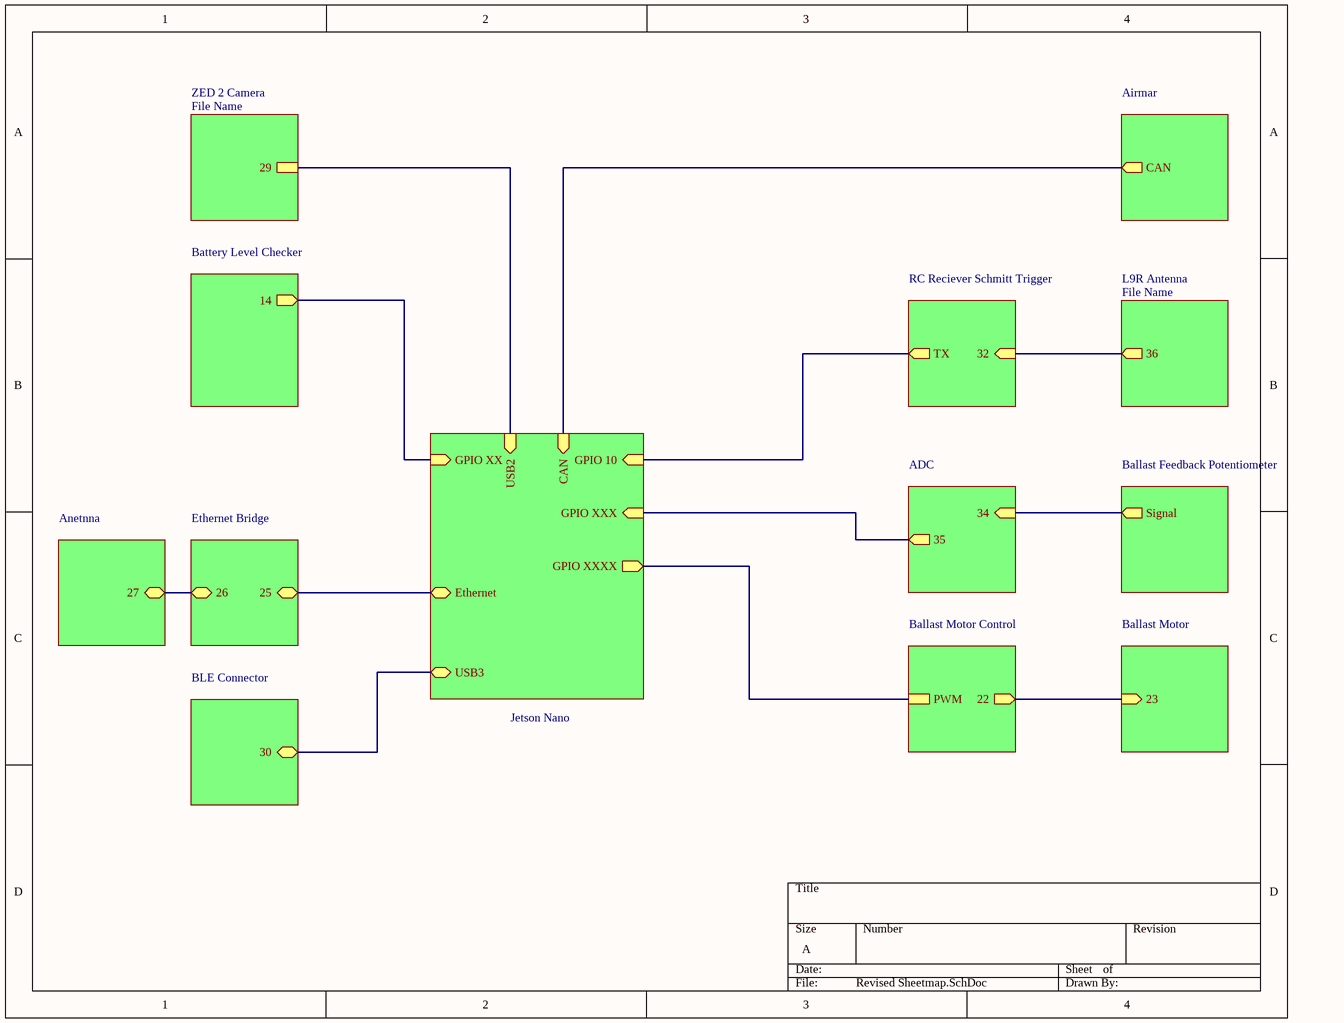
[diagram p9: Revised Sheetmap.SchDoc]

### Sub-sheets
ADC = File Name (file not in this document): 34 (in), 35 (out)
Airmar = File Name (file not in this document): CAN (out)
Anetnna = File Name (file not in this document): 27 (bidir)
Ballast Feedback Potentiometer = File Name (file not in this document): Signal (out)
Ballast Motor = File Name (file not in this document): 23 (in)
Ballast Motor Control = File Name (file not in this document): PWM, 22 (out)
Battery Level Checker = File Name (file not in this document): 14 (out)
BLE Connector = File Name (file not in this document): 30 (bidir)
Ethernet Bridge = File Name (file not in this document): 25 (bidir), 26 (bidir)
Jetson Nano = File Name (file not in this document): GPIO 10 (in), GPIO XXX (in), GPIO XXXX (out), CAN (in), GPIO XX (in), Ethernet (bidir), USB2 (in), USB3 (bidir)
L9R Antenna = File Name (file not in this document): 36 (out)
RC Reciever Schmitt Trigger = File Name (file not in this document): TX (out), 32 (in)
ZED 2 Camera = File Name (file not in this document): 29

### Nets
(unnamed): sheet Jetson Nano/GPIO 10, sheet RC Reciever Schmitt Trigger/TX
(unnamed): sheet Jetson Nano/GPIO XXX, sheet ADC/35
(unnamed): sheet Jetson Nano/GPIO XXXX, sheet Ballast Motor Control/PWM
(unnamed): sheet Jetson Nano/CAN, sheet Airmar/CAN
(unnamed): sheet Jetson Nano/GPIO XX, sheet Battery Level Checker/14
(unnamed): sheet Jetson Nano/Ethernet, sheet Ethernet Bridge/25
(unnamed): sheet Jetson Nano/USB2, sheet ZED 2 Camera/29
(unnamed): sheet Jetson Nano/USB3, sheet BLE Connector/30
(unnamed): sheet RC Reciever Schmitt Trigger/32, sheet L9R Antenna/36
(unnamed): sheet Ballast Feedback Potentiometer/Signal, sheet ADC/34
(unnamed): sheet Ballast Motor Control/22, sheet Ballast Motor/23
(unnamed): sheet Ethernet Bridge/26, sheet Anetnna/27

## Sheet Initital Sheetmap.SchDoc
size A; SheetNumber: 4; SheetTotal: 4
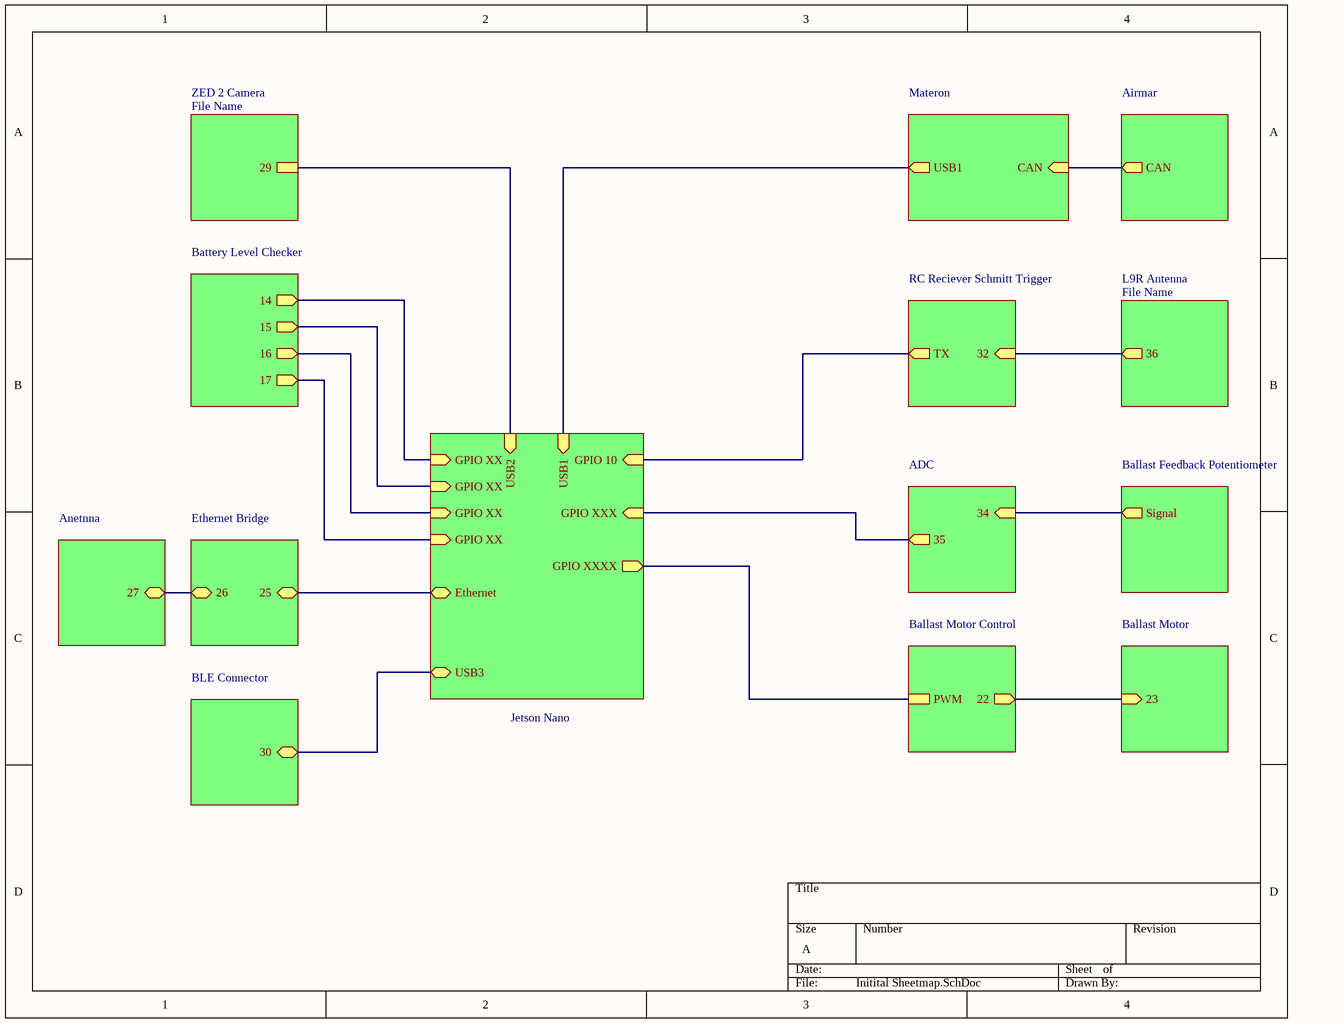
[diagram p10: Initital Sheetmap.SchDoc]

### Sub-sheets
ADC = File Name (file not in this document): 34 (in), 35 (out)
Airmar = File Name (file not in this document): CAN (out)
Anetnna = File Name (file not in this document): 27 (bidir)
Ballast Feedback Potentiometer = File Name (file not in this document): Signal (out)
Ballast Motor = File Name (file not in this document): 23 (in)
Ballast Motor Control = File Name (file not in this document): PWM, 22 (out)
Battery Level Checker = File Name (file not in this document): 14 (out), 15 (out), 16 (out), 17 (out)
BLE Connector = File Name (file not in this document): 30 (bidir)
Ethernet Bridge = File Name (file not in this document): 25 (bidir), 26 (bidir)
Jetson Nano = File Name (file not in this document): GPIO 10 (in), GPIO XXX (in), GPIO XXXX (out), USB1 (in), GPIO XX (in), GPIO XX (in), GPIO XX (in), GPIO XX (in), Ethernet (bidir), USB2 (in), USB3 (bidir)
L9R Antenna = File Name (file not in this document): 36 (out)
Materon = File Name (file not in this document): USB1 (out), CAN (in)
RC Reciever Schmitt Trigger = File Name (file not in this document): TX (out), 32 (in)
ZED 2 Camera = File Name (file not in this document): 29

### Nets
(unnamed): sheet Jetson Nano/GPIO 10, sheet RC Reciever Schmitt Trigger/TX
(unnamed): sheet Jetson Nano/GPIO XXX, sheet ADC/35
(unnamed): sheet Jetson Nano/GPIO XXXX, sheet Ballast Motor Control/PWM
(unnamed): sheet Jetson Nano/USB1, sheet Materon/USB1
(unnamed): sheet Jetson Nano/GPIO XX, sheet Battery Level Checker/14
(unnamed): sheet Jetson Nano/GPIO XX, sheet Battery Level Checker/15
(unnamed): sheet Jetson Nano/GPIO XX, sheet Battery Level Checker/16
(unnamed): sheet Jetson Nano/GPIO XX, sheet Battery Level Checker/17
(unnamed): sheet Jetson Nano/Ethernet, sheet Ethernet Bridge/25
(unnamed): sheet Jetson Nano/USB2, sheet ZED 2 Camera/29
(unnamed): sheet Jetson Nano/USB3, sheet BLE Connector/30
(unnamed): sheet RC Reciever Schmitt Trigger/32, sheet L9R Antenna/36
(unnamed): sheet Ballast Feedback Potentiometer/Signal, sheet ADC/34
(unnamed): sheet Ballast Motor Control/22, sheet Ballast Motor/23
(unnamed): sheet Materon/CAN, sheet Airmar/CAN
(unnamed): sheet Ethernet Bridge/26, sheet Anetnna/27

## Sheet Sail Sheetmap.SchDoc
size A; SheetNumber: 6; SheetTotal: 6
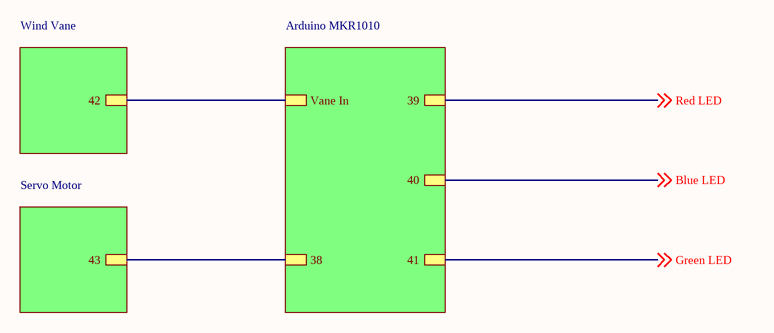
[diagram p11: Sail Sheetmap.SchDoc]

### Sub-sheets
Arduino MKR1010 = File Name (file not in this document): Vane In, 38, 39, 40, 41
Servo Motor = File Name (file not in this document): 43
Wind Vane = File Name (file not in this document): 42

### Nets
Blue LED: off-sheet Blue LED, sheet Arduino MKR1010/40
Green LED: off-sheet Green LED, sheet Arduino MKR1010/41
Red LED: off-sheet Red LED, sheet Arduino MKR1010/39
(unnamed): sheet Arduino MKR1010/Vane In, sheet Wind Vane/42
(unnamed): sheet Arduino MKR1010/38, sheet Servo Motor/43

## Nets that join several sheets
GND: Power Supply (15 pins), Jetson Nano Connector (8 pins), Ballast Motor Control (5 pins), ADC Module (9 pins), Status Light Control (7 pins), Battery Management System (19 pins), NMEA Power (J11#1.11 J11#1.12 J11#1.13), ESP32 Coprocessor (10 pins)
VCC3V3: Jetson Nano Connector (J2.1), ADC Module (B3.15 B3.16), ESP32 Coprocessor (J4#2.2 J11#2.2 J14.2)
VCC5V0: Power Supply (5 pins), Jetson Nano Connector (J2.2 J2.4), Ballast Motor Control (J4#1.2 J5#1.2), ADC Module (J6.2 J8.2 J9.2 U.4), ESP32 Coprocessor (5 pins)
VCC15V0: Power Supply (8 pins), Ballast Motor Control (J3#1.21 J3#1.22 J3#1.23), Status Light Control (6 pins), NMEA Power (J11#1.21 J11#1.22 J11#1.23)
NetB3_5: Ballast Motor Control (J5#1.1), ADC Module (B3.5)
NetB3_10: Jetson Nano Connector (J2.26), ADC Module (B3.10)
NetB3_11: Jetson Nano Connector (J2.19), ADC Module (B3.11)
NetB3_12: Jetson Nano Connector (J2.21), ADC Module (B3.12)
NetB3_13: Jetson Nano Connector (J2.23), ADC Module (B3.13)
NetJ1_11: Power Supply (J1.11 J1.12 J1.13), Battery Management System (R28.1 X1.1)
NetJ2_8: Jetson Nano Connector (J2.8), ESP32 Coprocessor (U1.34)
NetJ2_10: Jetson Nano Connector (J2.10), ESP32 Coprocessor (U1.35)
NetJ2_12: Jetson Nano Connector (J2.12), Ballast Motor Control (J4#1.1)
NetJ2_15: Jetson Nano Connector (J2.15), Status Light Control (Q4.1 R24.2)
NetJ2_29: Jetson Nano Connector (J2.29), Status Light Control (Q6.1 R26.2)
NetJ2_31: Jetson Nano Connector (J2.31), Status Light Control (Q2.1 R22.2)
NetJ2_32: Jetson Nano Connector (J2.32), ESP32 Coprocessor (U1.6)
NetJ2_33: Jetson Nano Connector (J2.33), ESP32 Coprocessor (U1.5)
NetJ10_2: ADC Module (U.12), Battery Management System (J10.2 R12.1)
NetJ10_3: ADC Module (R19.2), Battery Management System (J10.3 R11.1)
NetJ10_4: ADC Module (R17.2), Battery Management System (J10.4 R10.1)
NetJ10_5: ADC Module (R15.2), Battery Management System (J10.5 R8.1 R9.1 R27.2)
NetQ1_4: Power Supply (Q1.4 R1.2 S1.2), Battery Management System (Q9.2)